# Altium schematic sheet Cap 2.2uF 35V.schdoc
size 127 x 101 mm
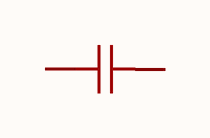
[diagram p0: Cap 2.2uF 35V.schdoc]

## Parts
C?  2.2uF  [C0402]  (value not drawn)

## Nets

Not connected (* = marked no-connect by the designer): C? 1 2

## Library data of the parts
C? = GRM155R6YA225KE11D: Manufacturer: muRata(村田); Add into BOM: yes; Tolerance: ±10%; Symbol: GRM155R6YA225KE11D; Device: GRM155R6YA225KE11D; LCSC Part Name: 2.2uF ±10% 35V; Supplier Part: C237392; Manufacturer Part: GRM155R6YA225KE11D; Supplier Footprint: 0402; JLCPCB Part Class: Extended Part; Datasheet: https://atta.szlcsc.com/upload/public/pdf/source/20200305/C490387_23319AE8C154DEB24C505E6C82A8106A.pdf; Supplier: LCSC; Convert to PCB: yes; Value: 2.2uF